# Altium schematic sheet Sheet1.SchDoc: AC Fan Controler By Bluetooth
size A4; CompanyName: AtoA; DrawnBy: Kasaee,Behboodi; Engineer: Kasaee,Behboodi; Revision: 1.0; SheetNumber: 1; SheetTotal: 1; ProjectName: AC Fan Controler By Bluetooth; Rule: PcbType=ProtelPcb
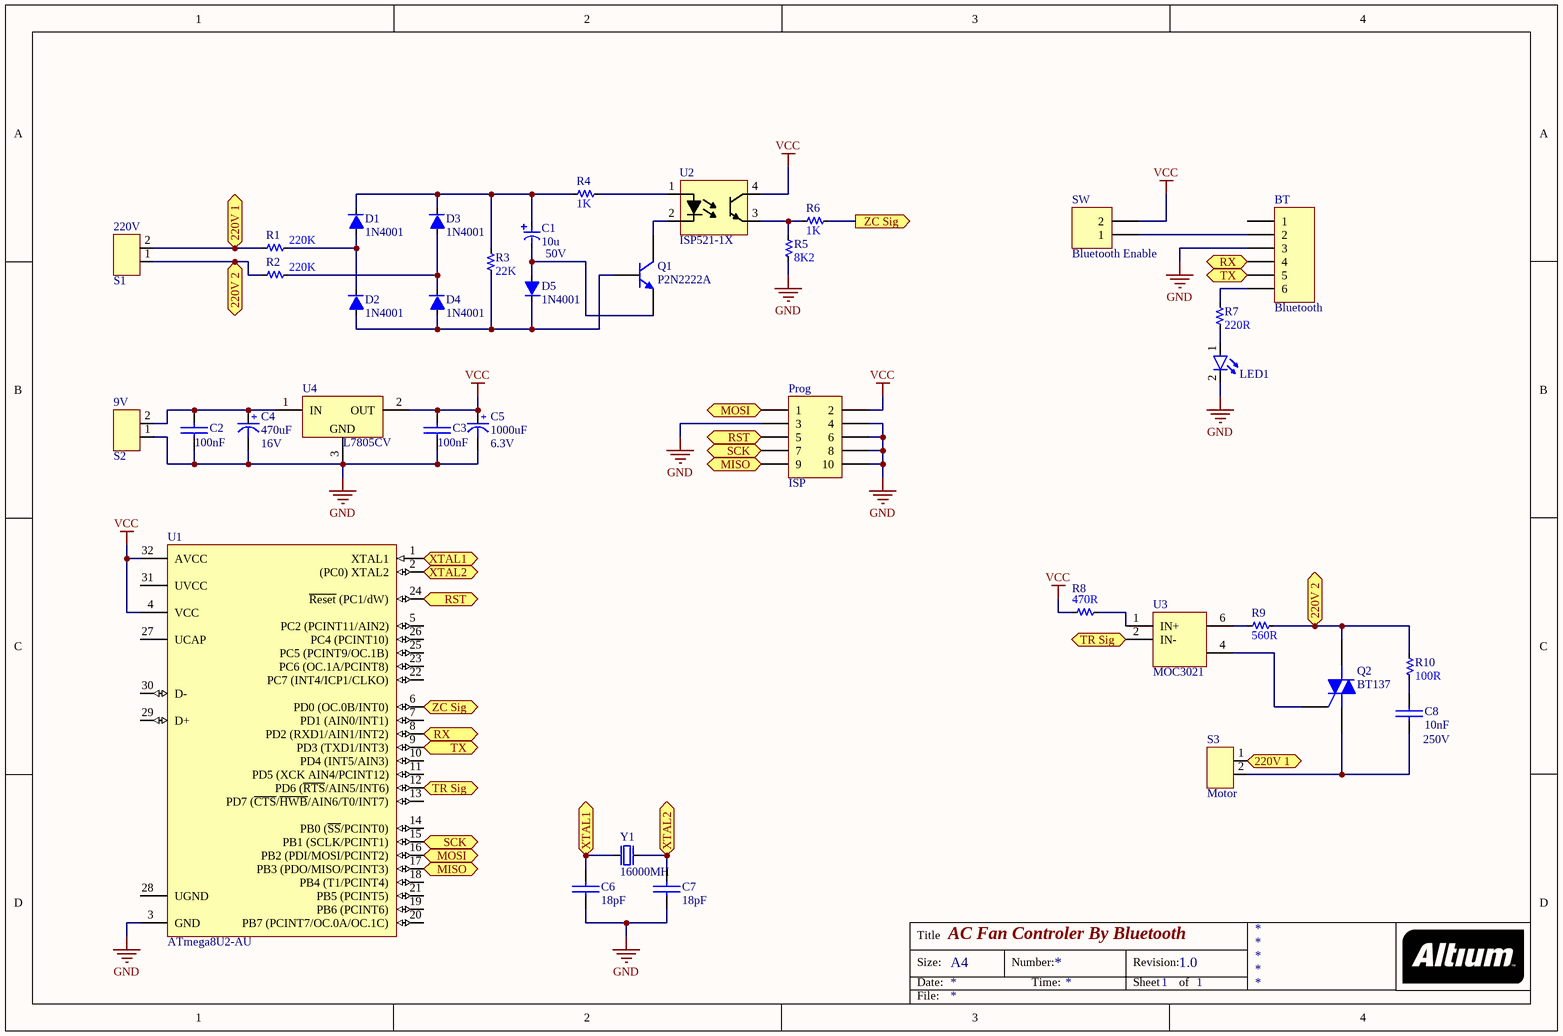
[diagram p0: Sheet1.SchDoc]

## Parts
BT  Bluetooth  [HDR1X6]
C1  50V  value 10u  [ELECTROLITE-3mmPIN]
C2  100nF  [Cap - 100nF]
C3  100nF  [Cap - 100nF]
C4  Voltage: 16V  [cap 01]  (hidden comment: 470uF)
C5  Voltage: 6.3V  [cap 04]  (hidden comment: 1000uF)
C6  18pF  [Cap - 100nF]
C7  18pF  [Cap - 100nF]
C8  value 10nF  [Cap - 100nF - 400V]  (hidden comment: 250V)
D1  value 1N4001  [DIODE]  (hidden comment: DIODE)
D2  value 1N4001  [DIODE]  (hidden comment: DIODE)
D3  value 1N4001  [DIODE]  (hidden comment: DIODE)
D4  value 1N4001  [DIODE]  (hidden comment: DIODE)
D5  value 1N4001  [DIODE]  (hidden comment: DIODE)
LED1  Red  [LED-5mm]  (value not drawn)
Prog  ISP  [IDC2.54-V10D]
Q1  P2N2222A  [29-04]
Q2  BT137  [TO-220AB]
R1  value 220K  [RESISTOR]  (hidden comment: Resistor)
R2  value 220K  [RESISTOR]  (hidden comment: Resistor)
R3  value 22K  [RESISTOR]  (hidden comment: Resistor)
R4  value 1K  [RESISTOR]  (hidden comment: Resistor)
R5  value 8K2  [RESISTOR]  (hidden comment: Resistor)
R6  value 1K  [RESISTOR]  (hidden comment: Resistor)
R7  value 220R  [RESISTOR]  (hidden comment: Resistor)
R8  value 470R  [RESISTOR]  (hidden comment: Resistor)
R9  value 560R  [RESISTOR]  (hidden comment: Resistor)
R10  value 100R  [RESISTOR]  (hidden comment: Resistor)
S1  220V  [PHONIX-2X]
S2  9V  [PHONIX-2X]
S3  Motor  [PHONIX-2X]
SW  Bluetooth Enable  [HDR1X2]
U1  ATmega8U2-AU  [32A_N]
U2  value ISP521-1X  [OPTO-521]  (hidden comment: PC817A)
U3  MOC3021  [DIP6E]
U4  L7805CV  [78XXCV - Right]
Y1  value 16000MH  [XTAL]  (hidden comment: XTAL)

## Ports
220V 1, 220V 2, MISO, MOSI, RST (in), RST (out), RX (in), RX (out), SCK (in), SCK (out), TR Sig (in), TR Sig (out), TX (in), TX (out), XTAL1, XTAL2, ZC Sig (in), ZC Sig (out)

## Nets
GND: BT.3 C2.2(-) C3.2(-) C4.2(-) C5.2(-) C6.2(-) C7.2(-) LED1.2(K) Prog.3 Prog.4 Prog.6 Prog.8 Prog.10 R5.2 S2.1 U1.3(GND) U4.3(GND)
VCC: C3.1(+) C5.1(+) Prog.2 R8.1 SW.2 U1.4(VCC) U1.32(AVCC) U2.4 U4.2(OUT)
220V 1: R1.1 S1.2 S3.1 ; port 220V 1
220V 2: Q2.2(M2) R2.1 R9.2 R10.1 S1.1 ; port 220V 2
MISO: Prog.9 U1.17(PB3_(PDO/MISO/PCINT3)) ; port MISO
MOSI: Prog.1 U1.16(PB2_(PDI/MOSI/PCINT2)) ; port MOSI
RST: Prog.5 U1.24(~{Reset}_(PC1/dW)) ; port RST
RX: BT.4 U1.8(PD2_(RXD1/AIN1/INT2)) ; port RX
SCK: Prog.7 U1.15(PB1_(SCLK/PCINT1)) ; port SCK
TR Sig: U1.12(PD6_(~{RTS}/AIN5/INT6)) U3.2(IN-) ; port TR Sig
TX: BT.5 U1.9(PD3_(TXD1/INT3)) ; port TX
XTAL1: C6.1(+) U1.1(XTAL1) Y1.1 ; port XTAL1
XTAL2: C7.1(+) U1.2((PC0)_XTAL2) Y1.2 ; port XTAL2
ZC Sig: R6.2 U1.6(PD0_(OC.0B/INT0)) ; port ZC Sig
NetBT_2: BT.2 SW.1
NetBT_6: BT.6 R7.2
NetC1_1: C1.1 D5.1 Q1.3(E)
NetC1_2: C1.2 D1.2 D3.2 R3.2 R4.1
NetC2_1: C2.1(+) C4.1(+) S2.2 U4.1(IN)
NetC8_1: C8.1(+) R10.2
NetC8_2: C8.2(-) Q2.1(M1) S3.2
NetD1_1: D1.1 D2.2 R1.2
NetD2_1: D2.1 D4.1 D5.2 Q1.2(B) R3.1
NetD3_1: D3.1 D4.2 R2.2
NetLED1_1: LED1.1(A) R7.1
NetQ1_1: Q1.1(C) U2.2
NetQ2_3: Q2.3(G) U3.4
NetR4_2: R4.2 U2.1
NetR5_1: R5.1 R6.1 U2.3
NetR8_2: R8.2 U3.1(IN+)
NetR9_1: R9.1 U3.6

Not connected (* = marked no-connect by the designer): BT 1; U1 5(PC2_(PCINT11/AIN2)) 7(PD1_(AIN0/INT1)) 10(PD4_(INT5/AIN3)) 11(PD5_(XCK_AIN4/PCINT12)) 13(PD7_(~{CTS}/~{HWB}/AIN6/T0/INT7)) 14(PB0_(~{SS}/PCINT0)) 18(PB4_(T1/PCINT4)) 19(PB6_(PCINT6)) 20(PB7_(PCINT7/OC.0A/OC.1C)) 21(PB5_(PCINT5)) 22(PC7_(INT4/ICP1/CLKO)) 23(PC6_(OC.1A/PCINT8)) 25(PC5_(PCINT9/OC.1B)) 26(PC4_(PCINT10)) 27(UCAP) 28(UGND) 29(D+) 30(D-) 31(UVCC)

## Notes on the sheet
- Title
- Size:
- Date:
- A4
- Number:
- Time:
- Revision:
- Sheet
- of
- File:

## Library data of the parts
BT = Header 6: Header, 6-Pin; LatestRevisionDate: 17-Jul-2002; LatestRevisionNote: Re-released for DXP Platform.; Publisher: Altium Limited
C1 = CAPACITOR(bigger than 10uF): Supplier_1: javan electronic; Supplier_2: *; Type: *
C2 C3 C6 C7 = Cap-Bipolar: Bipolar Capacitor; Voltage: 100V; Designer: Saeid Jorablo; Organazation: ControTec; Adding Date: 1387/12/20
  C2 C3: Value: 100nF
  C6 C7: Value: 18pF
C4 C5 = Cap-Polar: Polar Capacitor; Designer: Saeid Jorablo; Organazation: ControTec; Adding Date: 1387/12/20
  C4: Value: 470uF
  C5: Value: 1000uF
C8 = Cap-Bipolar: Bipolar Capacitor; Designer: Saeid Jorablo; Organazation: ControTec; Adding Date: 1387/12/20; Voltage: 250V
LED1 = LED: Designer: Saeid Jorablo; Organazation: ControTec; Adding Date: 1387/12/22; Color: Red; Size: 5mm
Prog = IDC 5X2: Header, 5-Pin, Dual row; LatestRevisionDate: 17-Jul-2002; LatestRevisionNote: Re-released for DXP Platform.; Publisher: Altium Limited
Q1 = P2N2222A: Amplifier Transistor NPN Silicon; Published: 29-Sep-2000; LatestRevisionDate: 17-Jul-2002; LatestRevisionNote: Re-released for DXP Platform.; DatasheetVersion: 1996; PackageVersion: 1996; PackageReference: 29-04; Publisher: Altium Limited; PackageDescription: TO, Flat Index; 3 In-Line, Axial Leads; Body Dia. 4.8mm; Leads 0.48 x 0.5 mm (max); ComponentLink1Description: Manufacturer Link; ComponentLink1URL: http://www.onsemi.com/site/products/landing?taxonomyID=194; ComponentLink2Description: Datasheet; ComponentLink2URL: http://www.onsemi.com/pub/Collateral/P2N2222A-D.PDF
Q2 = Q6008L5: Triac (8.0 Amps); Note: Tab is electrically isolated; Published: 8-Jun-2000; LatestRevisionDate: 17-Jul-2002; LatestRevisionNote: Re-released for DXP Platform.; PackageReference: TO-220AB; Publisher: Altium Limited; ComponentLink1Description: Manufacturer Link; ComponentLink1URL: http://www.littelfuse.com/; ComponentLink2Description: Datasheet; ComponentLink2URL: http://www.littelfuse.com/data/en/Data_Sheets/E2Triac.pdf
S1-S3 = CONNECTOR-2X: Supplier_1: *; Supplier_2: *; Type: *
  S1: Value: 220V
  S2: Value: 9V
  S3: Value: *
SW = Header 2: Header, 2-Pin; LatestRevisionDate: 17-Jul-2002; LatestRevisionNote: Re-released for DXP Platform.; Publisher: Altium Limited
U1 = ATmega8U2-AU: 8-bit AVR Microcontroller, 2.7-5.5V, 8KB Flash, 512 Bytes EEPROM, 512 Bytes SRAM, 32-pin TQFP, Industrial Grade (-40°C to 85°C); Published: 1-Apr-2010; DatasheetVersion: revC, Dec-2009; PackageVersion: revB, Oct-2001; PackageReference: 32A; Publisher: Altium Limited; PackageDescription: 32-Lead, 7x7x1.0 mm Body, 0.8mm Lead Pitch, Thin Profile Plastic Quad Flat Package (TQFP); Supplier 1: Digi-Key; Supplier Part Number 1: ATMEGA8U2-AU-ND; Supplier 2: Farnell; Supplier Part Number 2: 1748535; Supplier 3: Mouser; Supplier Part Number 3: 556-ATMEGA8U2-AU; Code_JEDEC: MS-026-ABA; ComponentLink1Description: Manufacturer Link; ComponentLink1URL: http://www.atmel.com/products/avr/default.asp?; ComponentLink2Description: ATmega8U2/16U2/32U2 Datasheet; ComponentLink2URL: http://www.atmel.com/dyn/resources/prod_documents/doc7799.pdf; ComponentLink3Description: ATmega8U2/16U2/32U2 Summary; ComponentLink3URL: http://www.atmel.com/dyn/resources/prod_documents/7799S.pdf; ComponentLink4Description: Atmel.com Home; ComponentLink4URL: http://www.atmel.com
U2 = OPTO-521: Type: *; Supplier_1: javan electronic; Supplier_2: *
U4 = L78XXCV: Fixed Voltage Regulator; Designer: Saeid Jorablo; Company: ControTec; Adding Date: 1387/01/06; Voltage: *
D1-D5 = DIODE: Supplier_1: javan electronic; Supplier_2: *; Type: *
R1-R10 = Resistor: Supplier_1: ka electronic; Type: 5%; Supplier_2: max electronic
Y1 = XTAL: Supplier_1: javan electronic; Supplier_2: *; Type: *